# Altium schematic sheet SCH.SchDoc
size A3; SheetNumber: 1; SheetTotal: 1
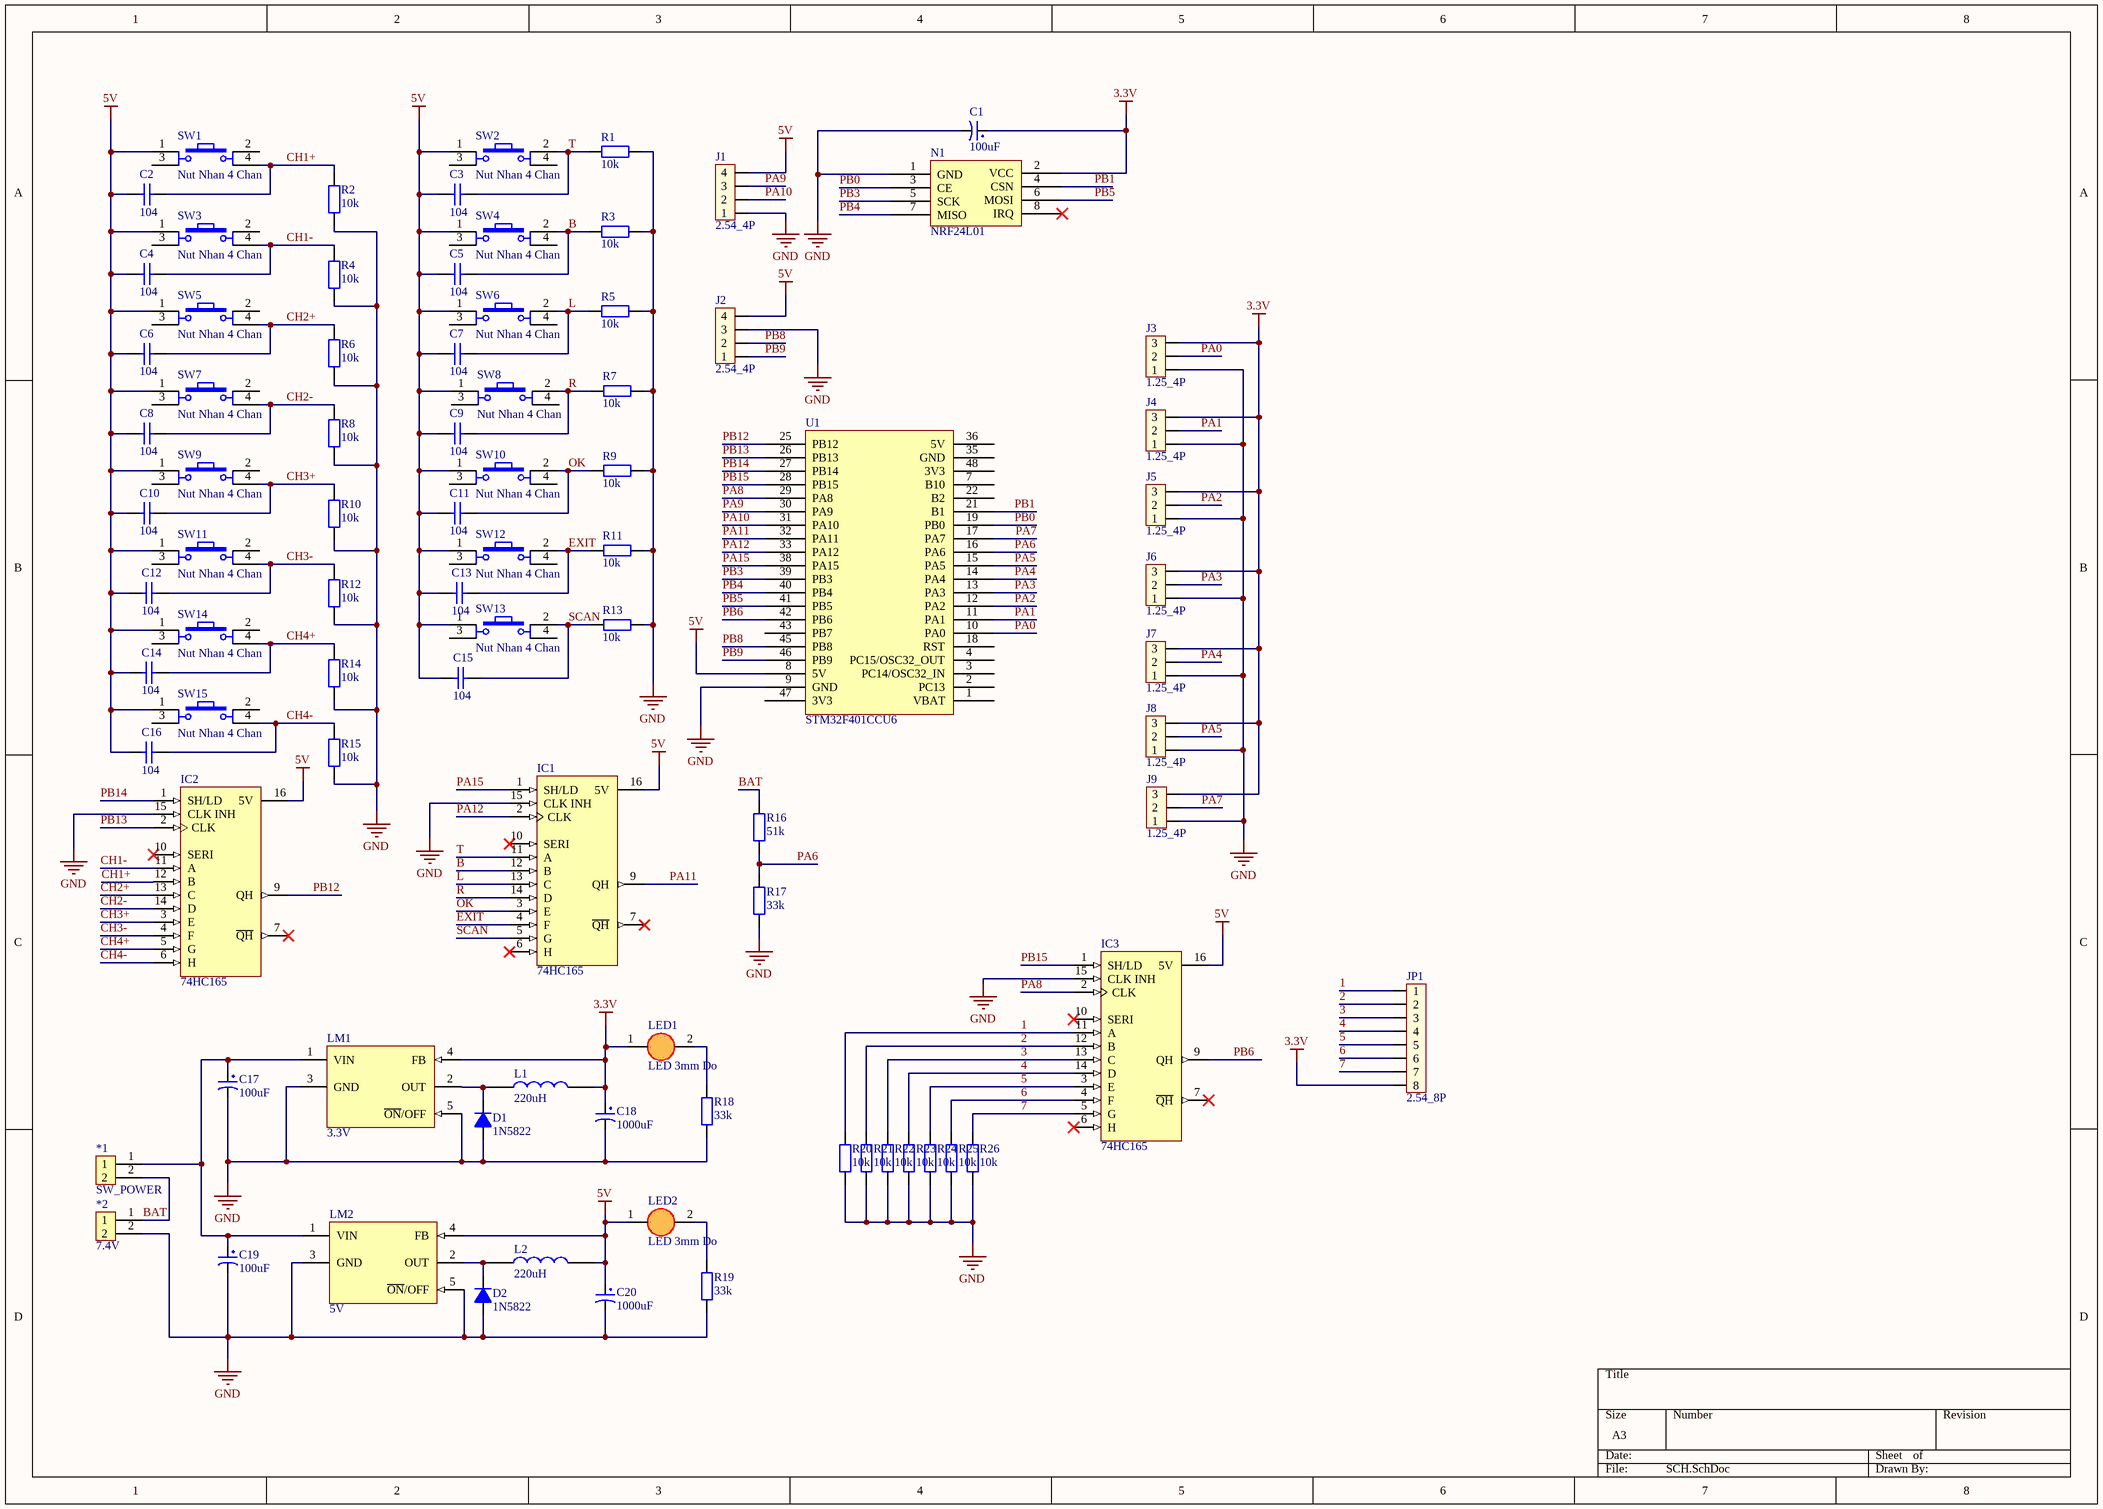
[diagram p0: SCH.SchDoc]

## Parts
*1  SW_POWER  [jump don duc_2p]
*2  7.4V  [jump don duc_2p]
C1  100uF  [tu hoa 5mm]
C2  104  [tu gom]
C3  104  [tu gom]
C4  104  [tu gom]
C5  104  [tu gom]
C6  104  [tu gom]
C7  104  [tu gom]
C8  104  [tu gom]
C9  104  [tu gom]
C10  104  [tu gom]
C11  104  [tu gom]
C12  104  [tu gom]
C13  104  [tu gom]
C14  104  [tu gom]
C15  104  [tu gom]
C16  104  [tu gom]
C17  100uF  [tu hoa 8mm]
C18  1000uF  [tu hoa 8mm]
C19  100uF  [tu hoa 8mm]
C20  1000uF  [tu hoa 8mm]
D1  1N5822  [D5A]
D2  1N5822  [D5A]
IC1  74HC165  [DIP16/W0.3]
IC2  74HC165  [DIP16/W0.3]
IC3  74HC165  [DIP16/W0.3]
J1  2.54_4P  [JP4]
J2  2.54_4P  [JP4]
J3  1.25_4P  [ZH1.25 3P]
J4  1.25_4P  [ZH1.25 3P]
J5  1.25_4P  [ZH1.25 3P]
J6  1.25_4P  [ZH1.25 3P]
J7  1.25_4P  [ZH1.25 3P]
J8  1.25_4P  [ZH1.25 3P]
J9  1.25_4P  [ZH1.25 3P]
JP1  2.54_8P  [JP8]
L1  220uH  [CUON CAM 100uH3A]
L2  220uH  [CUON CAM 100uH3A]
LED1  LED 3mm Do  [LED 3mm Do]
LED2  LED 3mm Do  [LED 3mm Do]
LM1  3.3V  [LM2576-5V]
LM2  5V  [LM2576-5V]
N1  NRF24L01  [NRF24L01]
R1  10k  [tro vach 1/4w]
R2  10k  [tro vach 1/4w]
R3  10k  [tro vach 1/4w]
R4  10k  [tro vach 1/4w]
R5  10k  [tro vach 1/4w]
R6  10k  [tro vach 1/4w]
R7  10k  [tro vach 1/4w]
R8  10k  [tro vach 1/4w]
R9  10k  [tro vach 1/4w]
R10  10k  [tro vach 1/4w]
R11  10k  [tro vach 1/4w]
R12  10k  [tro vach 1/4w]
R13  10k  [tro vach 1/4w]
R14  10k  [tro vach 1/4w]
R15  10k  [tro vach 1/4w]
R16  51k  [tro vach 1/4w]
R17  33k  [tro vach 1/4w]
R18  33k  [tro vach 1/4w]
R19  33k  [tro vach 1/4w]
R20  10k  [tro vach 1/4w]
R21  10k  [tro vach 1/4w]
R22  10k  [tro vach 1/4w]
R23  10k  [tro vach 1/4w]
R24  10k  [tro vach 1/4w]
R25  10k  [tro vach 1/4w]
R26  10k  [tro vach 1/4w]
SW1  Nut Nhan 4 Chan  [SW4]
SW2  Nut Nhan 4 Chan  [SW4]
SW3  Nut Nhan 4 Chan  [SW4]
SW4  Nut Nhan 4 Chan  [SW4]
SW5  Nut Nhan 4 Chan  [SW4]
SW6  Nut Nhan 4 Chan  [SW4]
SW7  Nut Nhan 4 Chan  [SW4]
SW8  Nut Nhan 4 Chan  [SW4]
SW9  Nut Nhan 4 Chan  [SW4]
SW10  Nut Nhan 4 Chan  [SW4]
SW11  Nut Nhan 4 Chan  [SW4]
SW12  Nut Nhan 4 Chan  [SW4]
SW13  Nut Nhan 4 Chan  [SW4]
SW14  Nut Nhan 4 Chan  [SW4]
SW15  Nut Nhan 4 Chan  [SW4]
U1  STM32F401CCU6  [STM32F401CCU6]

## Nets
3.3V: C1.1 C18.1 J3.3 J4.3 J5.3 J6.3 J7.3 J8.3 J9.3 JP1.8 L1.2 LED1.1(A) LM1.4(FB) N1.2(VCC)
5V: C2.2 C3.2 C4.2 C5.2 C6.2 C7.2 C8.2 C9.2 C10.2 C11.2 C12.2 C13.2 C14.2 C15.2 C16.2 C20.1 IC1.16(5V) IC2.16(5V) IC3.16(5V) J1.4 J2.4 L2.2 LED2.1(A) LM2.4(FB) SW1.1 SW2.1 SW3.1 SW4.1 SW5.1 SW6.1 SW7.1 SW8.1 SW9.1 SW10.1 SW11.1 SW12.1 SW13.1 SW14.1 SW15.1 U1.8(5V)
GND: *2.2 C1.2 C17.2 C18.2 C19.2 C20.2 D1.1(A) D2.1(A) IC1.8(GND) IC1.15(CLK_INH) IC2.8(GND) IC2.15(CLK_INH) IC3.8(GND) IC3.15(CLK_INH) J1.1 J2.3 J3.1 J4.1 J5.1 J6.1 J7.1 J8.1 J9.1 LM1.3(GND) LM1.5(~{ON}/OFF) LM2.3(GND) LM2.5(~{ON}/OFF) N1.1(GND) R1.2 R2.2 R3.2 R4.1 R5.2 R6.1 R7.2 R8.1 R9.2 R10.1 R11.2 R12.1 R13.2 R14.1 R15.1 R17.1 R18.2 R19.2 R20.1 R21.1 R22.1 R23.1 R24.1 R25.1 R26.1 U1.9(GND)
1: IC3.11(A) JP1.1 R20.2
2: IC3.12(B) JP1.2 R21.2
3: IC3.13(C) JP1.3 R22.2
4: IC3.14(D) JP1.4 R23.2
5: IC3.3(E) JP1.5 R24.2
6: IC3.4(F) JP1.6 R25.2
7: IC3.5(G) JP1.7 R26.2
B: C5.1 IC1.12(B) R3.1 SW4.2
BAT: *1.2 *2.1 R16.2
CH1+: C2.1 IC2.12(B) R2.1 SW1.4
CH1-: C4.1 IC2.11(A) R4.2 SW3.4
CH2+: C6.1 IC2.13(C) R6.2 SW5.4
CH2-: C8.1 IC2.14(D) R8.2 SW7.4
CH3+: C10.1 IC2.3(E) R10.2 SW9.4
CH3-: C12.1 IC2.4(F) R12.2 SW11.4
CH4+: C14.1 IC2.5(G) R14.2 SW14.4
CH4-: C16.1 IC2.6(H) R15.2 SW15.4
EXIT: C13.1 IC1.4(F) R11.1 SW12.2
L: C7.1 IC1.13(C) R5.1 SW6.2
OK: C11.1 IC1.3(E) R9.1 SW10.2
PA0: J3.2 U1.10(PA0)
PA1: J4.2 U1.11(PA1)
PA2: J5.2 U1.12(PA2)
PA3: J6.2 U1.13(PA3)
PA4: J7.2 U1.14(PA4)
PA5: J8.2 U1.15(PA5)
PA6: R16.1 R17.2 U1.16(PA6)
PA7: J9.2 U1.17(PA7)
PA8: IC3.2(CLK) U1.29(PA8)
PA9: J1.3 U1.30(PA9)
PA10: J1.2 U1.31(PA10)
PA11: IC1.9(QH) U1.32(PA11)
PA12: IC1.2(CLK) U1.33(PA12)
PA15: IC1.1(SH/LD) U1.38(PA15)
PB0: N1.3(CE) U1.19(PB0)
PB1: N1.4(CSN) U1.21(B1)
PB3: N1.5(SCK) U1.39(PB3)
PB4: N1.7(MISO) U1.40(PB4)
PB5: N1.6(MOSI) U1.41(PB5)
PB6: IC3.9(QH) U1.42(PB6)
PB8: J2.2 U1.45(PB8)
PB9: J2.1 U1.46(PB9)
PB12: IC2.9(QH) U1.25(PB12)
PB13: IC2.2(CLK) U1.26(PB13)
PB14: IC2.1(SH/LD) U1.27(PB14)
PB15: IC3.1(SH/LD) U1.28(PB15)
R: C9.1 IC1.14(D) R7.1 SW8.2
SCAN: C15.1 IC1.5(G) R13.1 SW13.2
T: C3.1 IC1.11(A) R1.1 SW2.2
Net*1_1: *1.1 C17.1 C19.1 LM1.1(VIN) LM2.1(VIN)
NetD1_2: D1.2(K) L1.1 LM1.2(OUT)
NetD2_2: D2.2(K) L2.1 LM2.2(OUT)
NetLED1_2: LED1.2(K) R18.1
NetLED2_2: LED2.2(K) R19.1

Not connected (* = marked no-connect by the designer): IC1 6(H)* 7(~{QH})* 10(SERI)*; IC2 7(~{QH})* 10(SERI)*; IC3 6(H)* 7(~{QH})* 10(SERI)*; N1 8(IRQ)*; SW1 2 3; SW2 3 4; SW3 2 3; SW4 3 4; SW5 2 3; SW6 3 4; SW7 2 3; SW8 3 4; SW9 2 3; SW10 3 4; SW11 2 3; SW12 3 4; SW13 3 4; SW14 2 3; SW15 2 3; U1 1(VBAT) 2(PC13) 3(PC14/OSC32_IN) 4(PC15/OSC32_OUT) 7(B10) 18(RST) 22(B2) 35(GND) 36(5V) 43(PB7) 47(3V3) 48(3V3)

## Library data of the parts
*1 *2 = jump don duc 2.54_2p
C1 = Tu Hoa 100uF 25V 6x11: Cắm; Don_Vi: Con; So_Chan: 2; Ten_Linh_Kien: Tụ Hóa 100uF 25V 6x11MM; Ma_Hang: MH001351; Chung_Loai: Cắm; Kieu_Chan: *
C2-C16 = Tu gom 104 50V: Cắm; So_Chan: 2; Ten_Linh_Kien: Tụ gốm 104 100nF 50V; Don_Vi: Con; Ma_Hang: MH004761; Chung_Loai: Cắm; Kieu_Chan: *
C17 C19 = Tu Hoa 100uF 50V 8x11: Cắm; Don_Vi: Con; So_Chan: 2; Ten_Linh_Kien: Tụ Hóa 100uF 50V 8x11MM; Ma_Hang: MH006872; Chung_Loai: Cắm; Kieu_Chan: *
C18 C20 = Tu Hoa 1000uF 16V 8x20: Cắm; Don_Vi: Con; So_Chan: 2; Ten_Linh_Kien: Tụ Hóa 1000uF 16V 8x20MM; Ma_Hang: MH008300; Chung_Loai: Cắm; Kieu_Chan: *
D1 D2 = D5A: Diode 5A; Value: 1N5408
IC1-IC3 = 74HC165: 8-Bit Parallel In/Serial Out Shift Register
J1 J2 = Jum Don Duc 2.54_4P: Cắm; Don_Vi: Con; Ma_Hang: MH000903; Value: Jump Đơn Đực 2.54MM 1x40P Thẳng 11MM; Ghi Chu: *; Kieu Chan: *; Chung_Loai: Cắm
J3-J9 = ZH1.25 3P: Cắm; Don_Vi: Con; Ma_Hang: MH000903; Value: Jump Đơn Đực 2.54MM 1x40P Thẳng 11MM; Ghi Chu: *; Kieu Chan: *; Chung_Loai: Cắm
JP1 = Jum Don Duc 2.54_8P: Cắm; Value: Jump Đơn Đực 2.54MM 1x40P Thẳng 11MM; Ma_Hang: MH000903; Don_Vi: Con; Ghi_Chu: *; Kieu Chan: *; Chung_Loai: Cắm
L1 L2 = CUON CAM 470uH DIP: Cắm; Don_Vi: Con; Ma_Hang: MH002232; Ten_Linh_Kien: Cuộn Cảm 470uH 3A 8x10MM; Ghi_Chu: *; Kieu_Chan: *; Chung_Loai: Cắm
LED1 LED2 = LED 3mm Do: Cắm; Ten_Linh_Kien: LED 3MM Sáng Đỏ ( SS); Ma_Hang: MH004931; Don_Vi: Con; Ghi_Chu: *; Kieu_Chan: *; Chung_Loai: Cắm
LM1 = LM2576_3.3V.: Cắm; Don_Vi: Con; Chung_Loai: Dán; Ma_Hang: MH001260; Ten_Linh_Kien: LM2576S-3.3V BUCK 3.3V 3A TO263-5; Ghi_Chu: *; Kieu_Chan: *
LM2 = LM2576_5V: Cắm; Don_Vi: Con; Chung_Loai: Dán; Ma_Hang: MH001260; Ten_Linh_Kien: LM2576S-3.3V BUCK 3.3V 3A TO263-5; Ghi_Chu: *; Kieu_Chan: *
R1-R26 = Tro Vach 1/4W 5% 10k: Căm; Chung_Loai: Cắm; Don_Vi: Con; So_Chan: 2; Ten_Linh_Kien: Trở Vạch 1/4w 5% 10K; Ma_Hang: MH007354; Kieu_Chan: *
SW1-SW15 = Nut Nhan 4 Chan: Cắm; Value: Nút Nhấn 4 Chân 6x6x9MM DIP; Ma_Hang: MH004077; Don_Vi: Con; Kieu Chan: *; Ghi Chu: *